# EAGLE design microBusPirate-v3 (EAGLE 5.11)

## Sheet 1 of 2
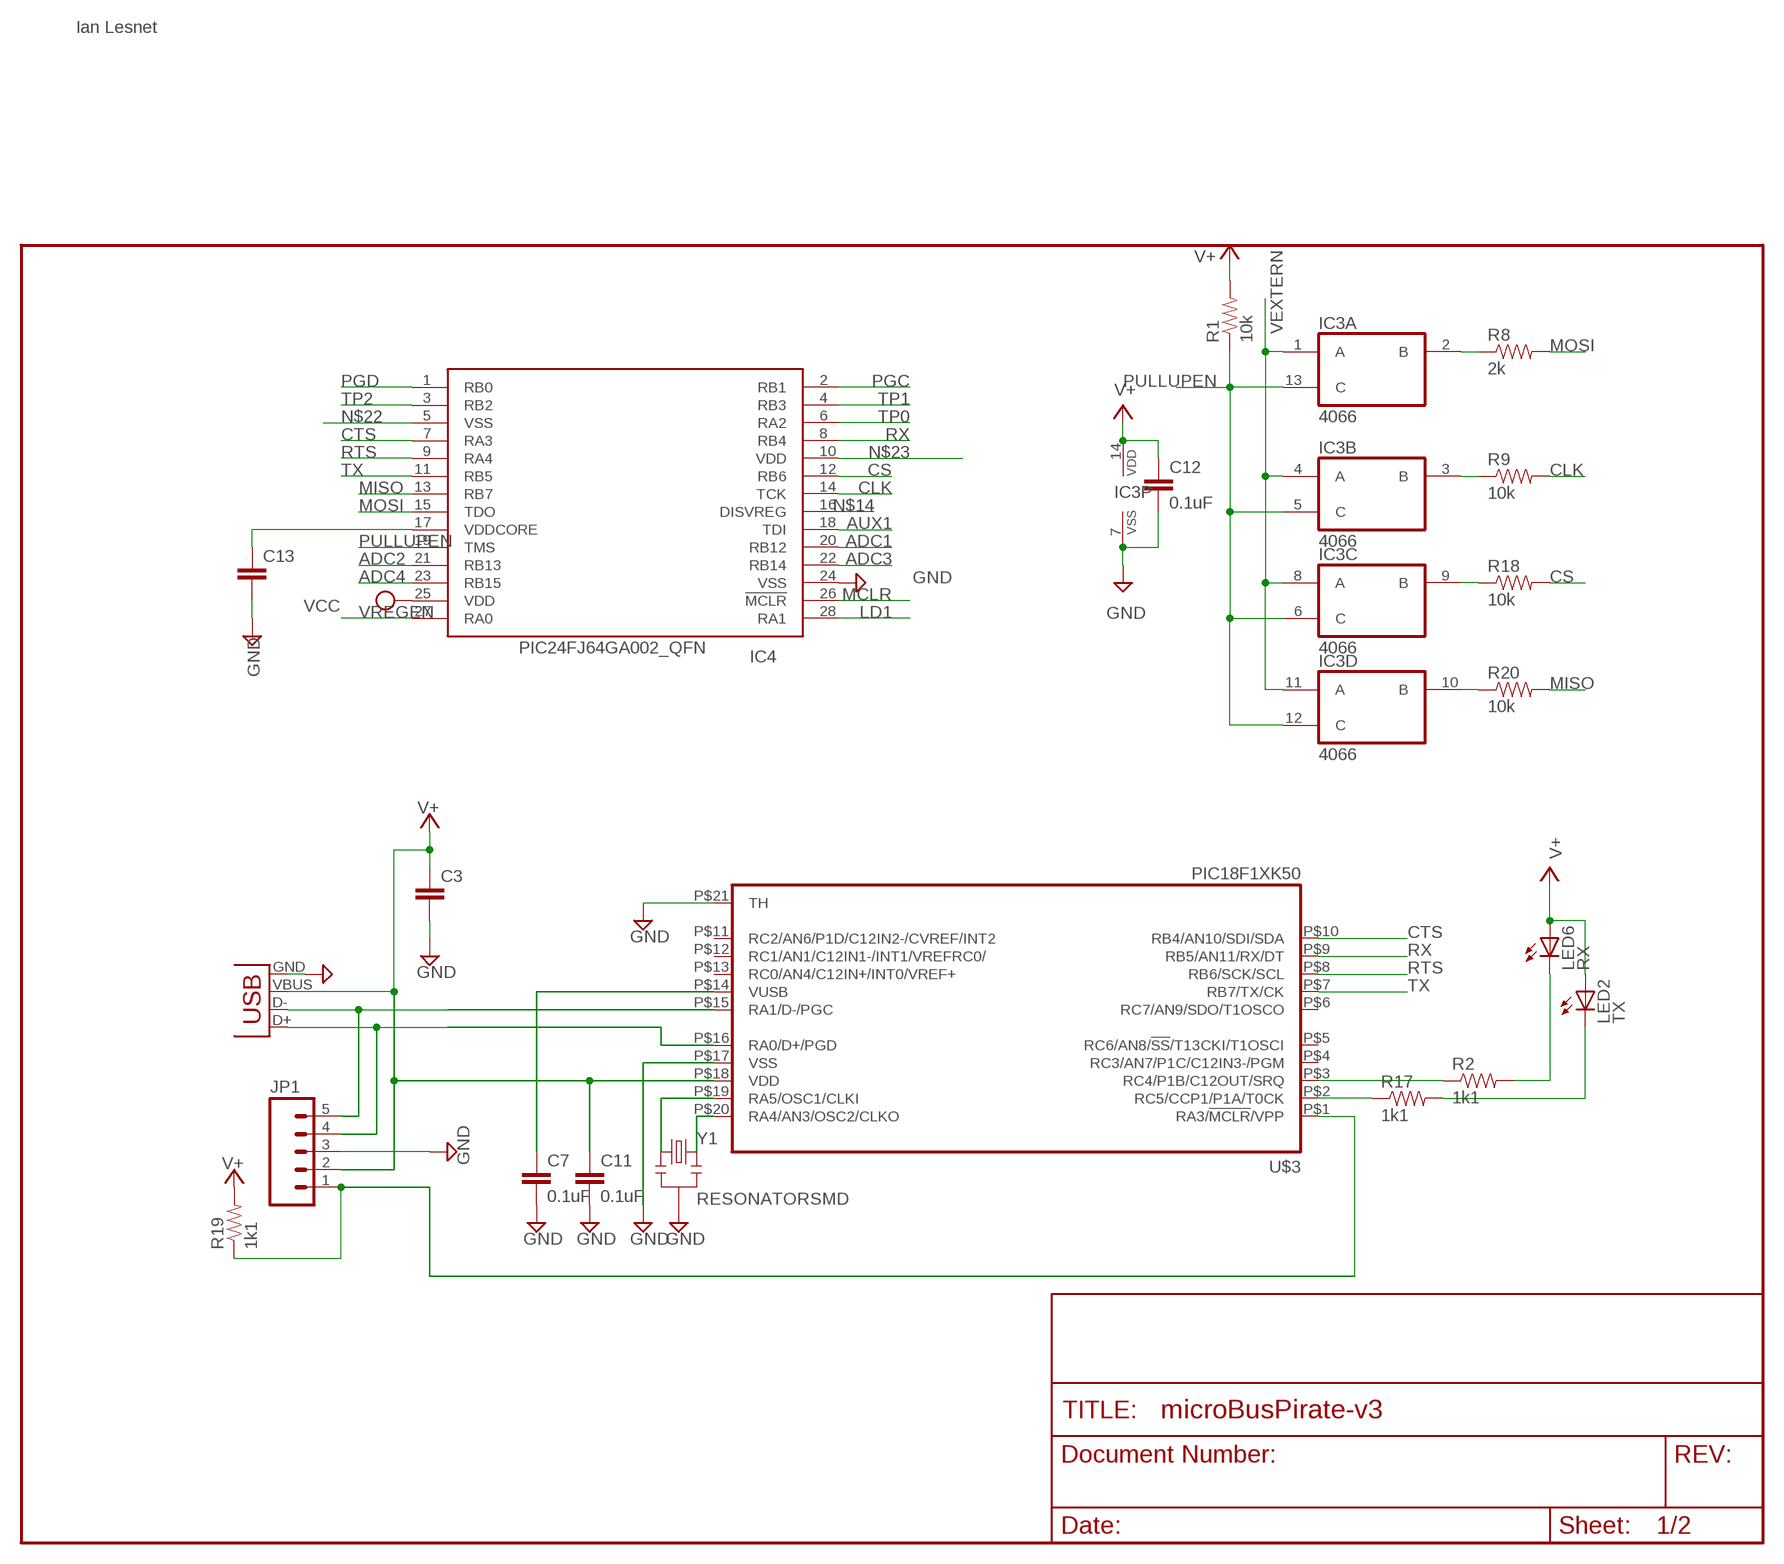
[diagram p0: schematic, sheet 1]

### Parts
C3  CAP0805  [0805]
C7  0.1uF  CAP  [0402-RES]
C11  0.1uF  CAP  [0402-RES]
C12  0.1uF  CAP  [0402-RES]
C13  CAP0805  [0805]
IC3  4066  [TSSOP14]
IC4  PIC24FJ64GA002_QFN  [QFN28-ML_6X6MM]
JP1  M051.27MM  [1X05-1.27MM]
LED2  TX  LED0603  [LED-0603]
LED6  RX  LED0603  [LED-0603]
R1  10k  RESISTOR0402-RES  [0402-RES]
R2  1k1  RESISTOR0402-RES  [0402-RES]
R8  2k  RESISTOR0402-RES  [0402-RES]
R9  10k  RESISTOR0402-RES  [0402-RES]
R17  1k1  RESISTOR0402-RES  [0402-RES]
R18  10k  RESISTOR0402-RES  [0402-RES]
R19  1k1  RESISTOR0402-RES  [0402-RES]
R20  10k  RESISTOR0402-RES  [0402-RES]
U$3  PIC18F1XK50  [QFN20]
X2  USBSMD  [USB-MINIB]
Y1  RESONATORSMD  [RESONATOR-SMD]

### Nets
ADC1: IC4.20(RB12) ; also sheet 2
ADC2: IC4.21(RB13) ; also sheet 2
ADC3: IC4.22(RB14) ; also sheet 2
ADC4: IC4.23(RB15) ; also sheet 2
AUX1: IC4.18(TDI) ; also sheet 2
CLK: IC4.14(TCK) R9.2 ; also sheet 2
CS: IC4.12(RB6) R18.2 ; also sheet 2
CTS: IC4.7(RA3) U$3.P$10(RB4/AN10/SDI/SDA)
D+: JP1.4 U$3.P$16(RA0/D+/PGD) X2.D+
D-: JP1.5 U$3.P$15(RA1/D-/PGC) X2.D-
GND: C3.2 C7.2 C11.2 C12.2 C13.2 IC3.7(P:VSS) IC4.24(VSS) JP1.3 U$3.P$17(VSS) U$3.P$21(TH) X2.GND Y1.2 ; also sheet 2
LD1: IC4.28(RA1) ; also sheet 2
MCLR: IC4.26(!MCLR) ; also sheet 2
MISO: IC4.13(RB7) R20.2 ; also sheet 2
MOSI: IC4.15(TDO) R8.2 ; also sheet 2
N$1: IC3.2(A:B) R8.1
N$2: IC3.3(B:B) R9.1
N$3: C13.1 IC4.17(VDDCORE)
N$4: IC3.10(D:B) R20.1
N$5: IC3.9(C:B) R18.1
N$8: C7.1 U$3.P$14(VUSB)
N$9: R17.1 U$3.P$2(RC5/CCP1/P1A/T0CK)
N$10: LED2.C R17.2
N$11: U$3.P$19(RA5/OSC1/CLKI) Y1.1
N$12: U$3.P$20(RA4/AN3/OSC2/CLKO) Y1.3
N$13: LED6.C R2.2
N$14: IC4.16(DISVREG)
N$19: R2.1 U$3.P$3(RC4/P1B/C12OUT/SRQ)
N$22: IC4.5(VSS)
N$23: IC4.10(VDD)
PGC: IC4.2(RB1) ; also sheet 2
PGD: IC4.1(RB0) ; also sheet 2
PULLUPEN: IC3.5(B:C) IC3.6(C:C) IC3.12(D:C) IC3.13(A:C) IC4.19(TMS) R1.1
RST: JP1.1 R19.1 U$3.P$1(RA3/!MCLR!/VPP)
RTS: IC4.9(RA4) U$3.P$8(RB6/SCK/SCL)
RX: IC4.8(RB4) U$3.P$9(RB5/AN11/RX/DT)
TP0: IC4.6(RA2)
TP1: IC4.4(RB3)
TP2: IC4.3(RB2)
TX: IC4.11(RB5) U$3.P$7(RB7/TX/CK)
V+: C3.1 C11.1 C12.1 IC3.14(P:VDD) JP1.2 LED2.A LED6.A R1.2 R19.2 U$3.P$18(VDD) X2.VBUS ; also sheet 2
VCC: IC4.25(VDD) ; also sheet 2
VEXTERN: IC3.1(A:A) IC3.4(B:A) IC3.8(C:A) IC3.11(D:A) ; also sheet 2
VREGEN: IC4.27(RA0) ; also sheet 2
Unconnected: U$3.P$4(RC3/AN7/P1C/C12IN3-/PGM) U$3.P$5(RC6/AN8/!SS!/T13CKI/T1OSCI) U$3.P$6(RC7/AN9/SDO/T1OSCO) U$3.P$11(RC2/AN6/P1D/C12IN2-/CVREF/INT2) U$3.P$12(RC1/AN1/C12IN1-/INT1/VREFRC0/) U$3.P$13(RC0/AN4/C12IN+/INT0/VREF+)

### Notes on the sheet
- Ian Lesnet

## Sheet 2 of 2
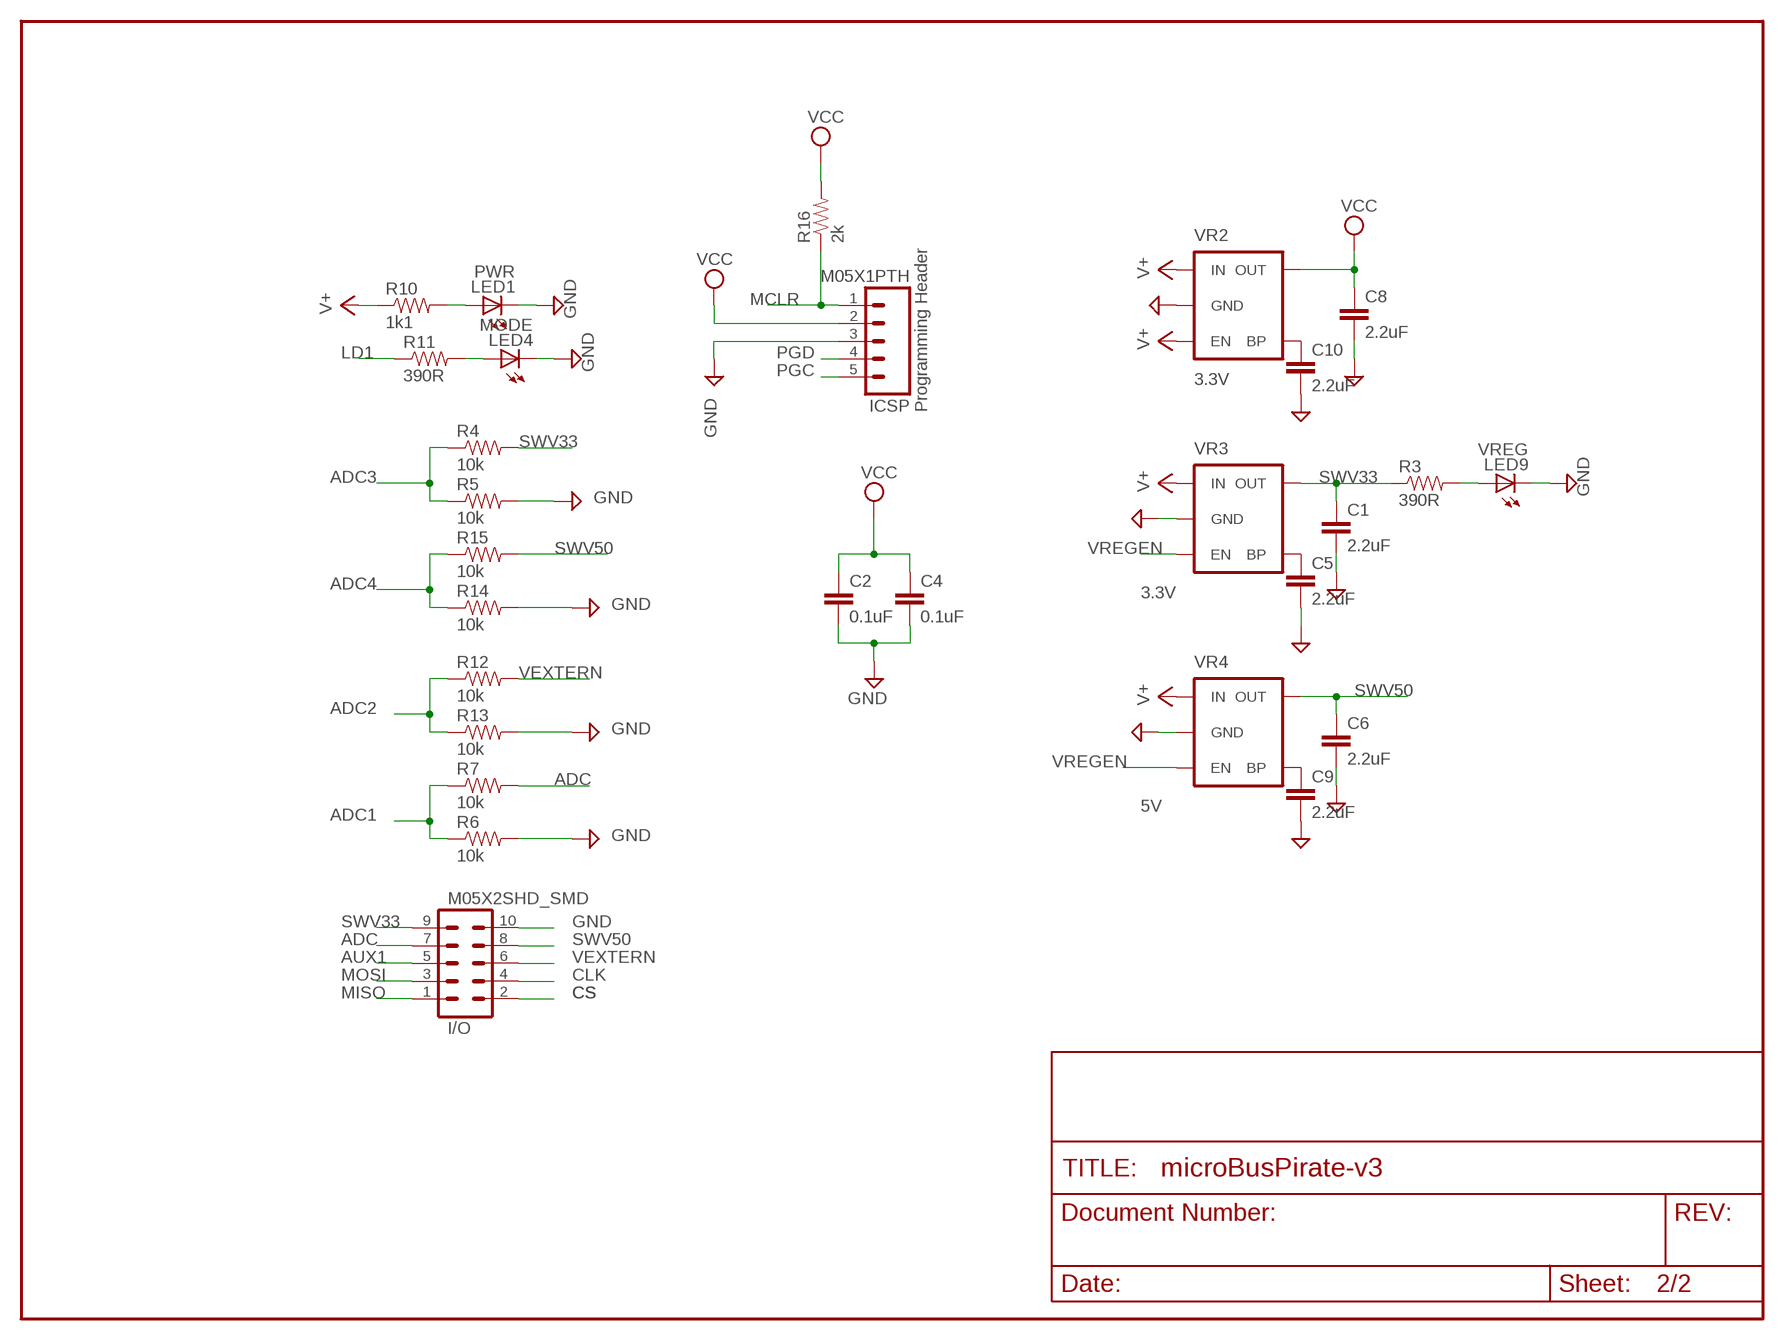
[diagram p1: schematic, sheet 2]

### Parts
C1  2.2uF  CAP  [0402-RES]
C2  0.1uF  CAP  [0402-RES]
C4  0.1uF  CAP  [0402-RES]
C5  2.2uF  CAP  [0402-RES]
C6  2.2uF  CAP  [0402-RES]
C8  2.2uF  CAP  [0402-RES]
C9  2.2uF  CAP  [0402-RES]
C10  2.2uF  CAP  [0402-RES]
I/O  M05X2SHD_SMD  [2X5-SHROUDED_SMD]
ICSP  M05X1PTH  M051.27MM  [1X05-1.27MM]
LED1  PWR  LED0603  [LED-0603]
LED4  MODE  LED0603  [LED-0603]
LED9  VREG  LED0603  [LED-0603]
R3  390R  RESISTOR0402-RES  [0402-RES]
R4  10k  RESISTOR0402-RES  [0402-RES]
R5  10k  RESISTOR0402-RES  [0402-RES]
R6  10k  RESISTOR0402-RES  [0402-RES]
R7  10k  RESISTOR0402-RES  [0402-RES]
R10  1k1  RESISTOR0402-RES  [0402-RES]
R11  390R  RESISTOR0402-RES  [0402-RES]
R12  10k  RESISTOR0402-RES  [0402-RES]
R13  10k  RESISTOR0402-RES  [0402-RES]
R14  10k  RESISTOR0402-RES  [0402-RES]
R15  10k  RESISTOR0402-RES  [0402-RES]
R16  2k  RESISTOR0402-RES  [0402-RES]
VR2  3.3V  V_REG_LDOSMD  [SOT23-5]
VR3  3.3V  V_REG_LDOSMD  [SOT23-5]
VR4  5V  V_REG_LDOSMD  [SOT23-5]

### Nets
ADC: I/O.7 R7.2
ADC1: R6.1 R7.1 ; also sheet 1
ADC2: R12.1 R13.1 ; also sheet 1
ADC3: R4.1 R5.1 ; also sheet 1
ADC4: R14.1 R15.1 ; also sheet 1
AUX1: I/O.5 ; also sheet 1
CLK: I/O.4 ; also sheet 1
CS: I/O.2 ; also sheet 1
GND: C1.2 C2.2 C4.2 C5.2 C6.2 C8.2 C9.2 C10.2 I/O.10 ICSP.3 LED1.C LED4.C LED9.C R5.2 R6.2 R13.2 R14.2 VR2.2(GND) VR3.2(GND) VR4.2(GND) ; also sheet 1
LD1: R11.1 ; also sheet 1
MCLR: ICSP.1 R16.1 ; also sheet 1
MISO: I/O.1 ; also sheet 1
MOSI: I/O.3 ; also sheet 1
N$6: LED4.A R11.2
N$7: LED1.A R10.2
N$15: C9.1 VR4.4(BP)
N$16: C5.1 VR3.4(BP)
N$17: C10.1 VR2.4(BP)
N$18: LED9.A R3.2
PGC: ICSP.5 ; also sheet 1
PGD: ICSP.4 ; also sheet 1
SWV33: C1.1 I/O.9 R3.1 R4.2 VR3.5(OUT)
SWV50: C6.1 I/O.8 R15.2 VR4.5(OUT)
V+: R10.1 VR2.1(IN) VR2.3(EN) VR3.1(IN) VR4.1(IN) ; also sheet 1
VCC: C2.1 C4.1 C8.1 ICSP.2 R16.2 VR2.5(OUT) ; also sheet 1
VEXTERN: I/O.6 R12.2 ; also sheet 1
VREGEN: VR3.3(EN) VR4.3(EN) ; also sheet 1

### Notes on the sheet
- Programming Header

## Library data of the parts
C1 C2 C4-C12 = Gregs:CAP: Capacitor Standard 0603 ceramic capacitor, and 0.1" leaded capacitor.
C3 C13 = SparkFun:CAP: Capacitor Standard 0603 ceramic capacitor, and 0.1" leaded capacitor.
I/O = SparkFun:M05X2: Header 5x2 Standard 10-pin dual row 0.1" header. Commonly used with AVR-ISP. Use with Spark Fun Electronics SKU: PRT-00778
IC3 = Gregs:4066: Quad bilateral ANALOG SWITCH
IC4 = microchip:PIC24FJ64GA002_QFN: PIC24FJ64GA002_QFN edit this description Auto generated by make-symbol-device-package-bsdl.ulp Rev. 25 Source: PIC24FJ64GA002_QFN.bsd
ICSP JP1 = SparkFun:M05: Header 5 Standard 5-pin 0.1" header. Use with straight break away headers (SKU : PRT-00116), right angle break away headers (PRT-00553), swiss pins (PRT-00743), machine pins (PRT-00117), and female headers (PRT-00115). Molex polarized connector foot print use with SKU : PRT-08230 with associated crimp pins and housings.
LED1 LED2 LED4 LED6 LED9 = SparkFun:LED: LEDs Standard schematic elements and footprints for 5mm, 3mm, 1206, and 0603 sized LEDs. 5mm - Spark Fun Electronics SKU : COM-00529 (and others)
R1-R20 = Gregs:RESISTOR: Resistor Basic schematic elements and footprints for 0603, 1206, and PTH 1/10th watt (small) resistors.
U$3 = Gregs:PIC18F1XK50
VR2-VR4 = SparkFun:V_REG_LDO: Voltage Regulator LDO Standard 150mA LDO voltage regulator in SOT-23 layout. Micrel part MIC5205. BP (by-pass) pin is used to lower output noise with 470pF cap.
X2 = SparkFun:USB: USB Connectors USB-B-PTH is fully proven SKU : PRT-00139 USB-miniB is fully proven SKU : PRT-00587 USB-A-PCB is untested. USB-A-H is throughly reviewed, but untested. Spark Fun Electronics SKU : PRT-00437 USB-B-SMT is throughly reviewed, but untested. Needs silkscreen touching up. USB-A-S has not been used/tested USB-MB-H has not been used/tested
Y1 = SparkFun:RESONATOR: Resonator Small SMD resonator. This is the itty bitty 10/20MHz resonators with built in caps. CSTCE10M0G55 and CSTCE20M0V53. Footprint has been reviewed closely but hasn't been tested yet.

## Board
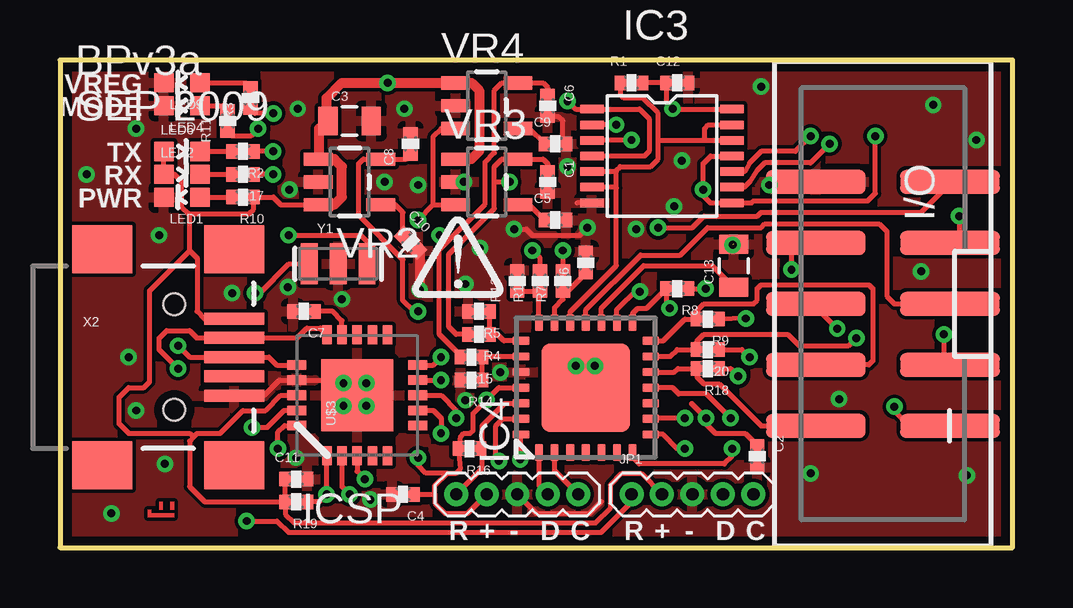
[diagram p2: board, top side]
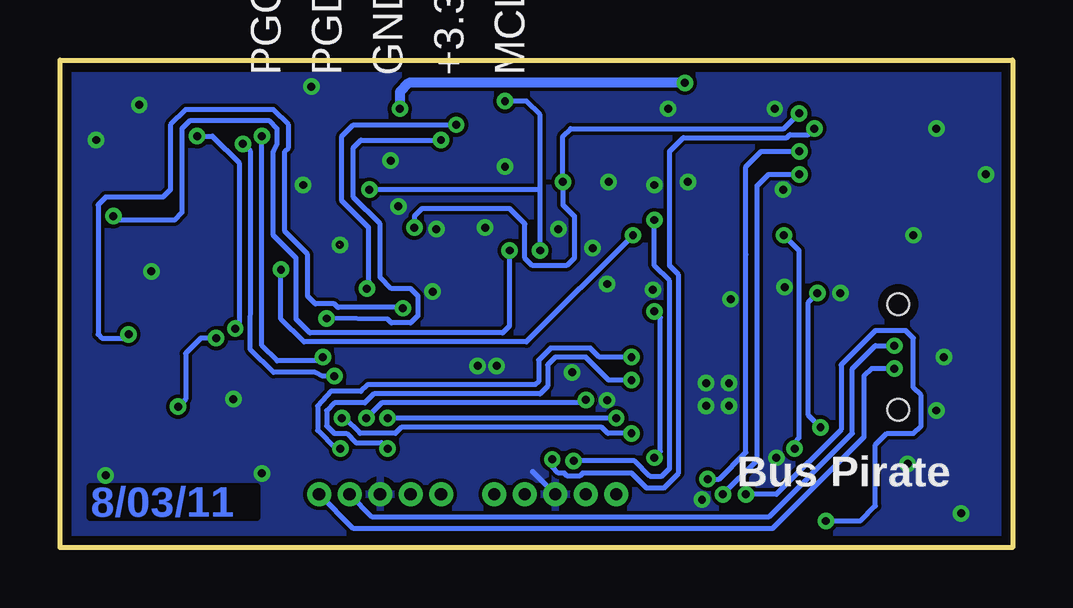
[diagram p3: board, bottom side, seen from below]

Size 39.69 x 20.32 mm. Coordinates in mm from the lower left corner, seen from the top.
Outline: 39.69,0 39.69,20.32 0,20.32 0,0 39.69,0
Copper layers (1*16): Top 0.0356mm / dielectric 1.5011mm / Bottom 0.0356mm
Design rules "LaenPCBOrder": minimum track width 6mil, minimum drill 13mil, track to track 6mil, track to pad 6mil, pad to pad 6mil, via to via 6mil, smd to smd 6mil, copper to edge 15mil, drill to drill 6mil, minimum pad ring 7mil, minimum via ring 7mil, stop-mask expansion 4mil, vias tented up to drill 20mil, thermal gap 10mil

### Footprints (pad centres in the part's own frame; a part is rotated, then mirrored left to right if it is on the bottom)
0402-RES = smd 0.5 x 0.6: 1 -0.45,0; 2 0.45,0
0805 = smd 0.8 x 1.2: 1 -0.9,0; 2 0.9,0
2X5-SHROUDED_SMD = smd 4.15 x 1: 1 -2.794,5.08; 2 2.794,5.08; 3 -2.794,2.54; 4 2.794,2.54; 5 -2.794,0; 6 2.794,0; 7 -2.794,-2.54; 8 2.794,-2.54; 9 -2.794,-5.08; 10 2.794,-5.08
TSSOP14 = smd 0.356 x 0.991: 1 -1.95,-2.918; 2 -1.3,-2.918; 3 -0.65,-2.918; 4 0,-2.918; 5 0.65,-2.918; 6 1.3,-2.918; 7 1.95,-2.918; 8 1.95,2.918; 9 1.3,2.918; 10 0.65,2.918; 11 0,2.918; 12 -0.65,2.918; 13 -1.3,2.918; 14 -1.95,2.918
QFN28-ML_6X6MM = smd 0.7 x 0.35: 1 -2.7,1.95; 2 -2.7,1.3; 3 -2.7,0.65; 4 -2.7,0; 5 -2.7,-0.65; 6 -2.7,-1.3; 7 -2.7,-1.95; 15 2.7,-1.95; 16 2.7,-1.3; 17 2.7,-0.65; 18 2.7,0; 19 2.7,0.65; 20 2.7,1.3; 21 2.7,1.95 | smd 0.35 x 0.7: 8 -1.95,-2.7; 9 -1.3,-2.7; 10 -0.65,-2.7; 11 0,-2.7; 12 0.65,-2.7; 13 1.3,-2.7; 14 1.95,-2.7; 22 1.95,2.7; 23 1.3,2.7; 24 0.65,2.7; 25 0,2.7; 26 -0.65,2.7; 27 -1.3,2.7; 28 -1.95,2.7 | smd 3.7 x 3.7: EXP 0,0
1X05-1.27MM = drill 0.508 pad 1 round: 1 0,0; 2 1.27,0; 3 2.54,0; 4 3.81,0; 5 5.08,0
LED-0603 = smd 0.8 x 0.8: A 0,-0.75; C 0,0.75
QFN20 = smd 0.8 x 0.4: P$1 -2.52,1.26; P$2 -2.52,0.63; P$3 -2.52,0; P$4 -2.52,-0.63; P$5 -2.52,-1.26; P$11 2.52,-1.26; P$12 2.52,-0.63; P$13 2.52,0; P$14 2.52,0.63; P$15 2.52,1.26 | smd 0.4 x 0.8: P$6 -1.26,-2.52; P$7 -0.63,-2.52; P$8 0,-2.52; P$9 0.63,-2.52; P$10 1.26,-2.52; P$16 1.26,2.52; P$17 0.63,2.52; P$18 0,2.52; P$19 -0.63,2.52; P$20 -1.26,2.52 | smd 3 x 3: P$21 0,0
SOT23-5 = smd 0.55 x 1.2: 1 -0.95,-1.3; 2 0,-1.3; 3 0.95,-1.3; 4 0.95,1.3; 5 -0.95,1.3
USB-MINIB = smd 2.5 x 0.5: D+ 2.5,0; D- 2.5,0.8; GND 2.5,-1.6; ID 2.5,-0.8; VBUS 2.5,1.6 | smd 2.5 x 2: GND@1 -3,-4.5; GND@2 -3,4.5; GND@3 2.5,4.5; GND@4 2.5,-4.5 | hole 0.9: 0,2.2; 0,-2.2
RESONATOR-SMD = smd 0.7 x 1.7: 1 -1.2,0; 2 0,0; 3 1.2,0

### Placement (x,y rotation side)
C1  20.32,15.24 270 top
C2  29.05,3.81 270 top
C3  12.06,17.78 0 top
C4  14.29,2.22 180 top
C5  20.64,13.65 0 top
C6  20.32,18.41 270 top
C7  10.16,9.84 180 top
C8  14.61,16.83 90 top
C9  20.64,16.83 0 top
C10  14.61,12.7 315 top
C11  9.84,2.86 0 top
C12  25.72,19.37 0 top
C13  28.07,11.75 90 top
I/O  34.29,10.16 180 top
IC3  25.08,16.32 270 top
IC4  21.91,6.67 90 top
ICSP  16.51,2.22 0 top
JP1  23.81,2.22 0 top
LED1  5.08,14.61 90 top
LED2  5.08,15.56 270 top
LED4  5.08,18.41 90 top
LED6  5.08,16.51 270 top
LED9  5.08,19.37 90 top
R1  23.81,19.37 0 top
R2  7.62,16.51 180 top
R3  7.94,18.73 90 top
R4  17.46,8.89 180 top
R5  17.46,9.84 180 top
R6  21.91,11.87 90 top
R7  20.95,11.11 90 top
R8  25.72,10.79 180 top
R9  26.99,9.53 180 top
R10  7.62,14.61 180 top
R11  6.99,17.78 90 top
R12  20,11.11 90 top
R13  19.05,11.11 90 top
R14  17.14,6.99 180 top
R15  17.14,7.94 180 top
R16  17.07,4.13 180 top
R17  7.62,15.56 180 top
R18  26.99,7.46 180 top
R19  9.84,1.91 180 top
R20  26.99,8.26 180 top
U$1  [DP-LOGO]  14.67,10.41 0 top
U$3  12.38,6.35 90 top
VR2  12.06,15.24 270 top
VR3  17.78,15.24 270 top
VR4  17.78,18.41 270 top
X2  4.76,7.94 0 top
Y1  11.59,11.83 0 top

### Tracks (layer width: path | path; a pad name or v marks a point on that pad's centre or on a via)
ADC  (via drill 0.33)
  Top 0.203: v20.95,12.38 R7.2 | I/O.7 37.47,12.7 v37.47,13.81
  Bottom 0.203: v20.95,12.38 20.95,9.24 21.24,8.95 29.27,8.95 29.84,9.53 29.84,12.06 30.8,13.02 30.8,16.51 30.64,16.83 30.64,17.46 30.96,17.78 34.29,17.78 34.61,17.46 34.61,13.97 34.92,13.65 37.31,13.65 v37.47,13.81
ADC1
  Top 0.203: IC4.20 20.61,10 20.95,10.35 R7.1 21.14,10.66 R6.1
ADC2
  Top 0.203: IC4.21 19.96,10.62 R12.1 R13.1
ADC3
  Top 0.203: IC4.22 18.5,8.62 18.22,8.89 R4.1 R5.1
ADC4
  Top 0.203: IC4.23 17.62,7.97 R15.1 R14.1
AUX1
  Top 0.203: IC4.18 21.91,9.91 24.19,12.19 25.84,12.19 26.99,13.34 29.21,13.34 29.37,13.49 29.53,13.49 34.13,13.49 34.45,13.18 34.45,10.48 34.77,10.16 I/O.5
CLK
  Top 0.203: IC4.14 25.13,8.62 26.04,9.53 R9.2 26.54,9.87 26.83,10.16 28.89,10.16 29.05,10.32 29.05,10.79 29.21,10.95 33.71,10.95 33.87,10.79 33.87,7.78 33.71,7.62 I/O.4
CS
  Top 0.203: IC4.12 25.58,7.32 25.75,7.46 R18.2 26.54,7.12 26.83,6.83 27.46,6.83 29.21,5.08 I/O.2 32.38,5.08
CTS  (via drill 0.33)
  Top 0.203: U$3.P$10 15.55,7.61 v15.88,7.94 | IC4.7 23.86,3.77 24.13,3.49 27.69,3.49 28,3.81 v28,4.13
  Bottom 0.203: v28,4.13 28.19,4.13 28.96,4.89 28.96,5.91 28.42,6.51 27.15,6.51 26.86,6.79 19.88,6.79 19.75,6.92 19.75,7.81 19.24,8.32 17.59,8.32 17.21,7.94 v15.88,7.94
D+  (via drill 0.33)
  Top 0.203: U$3.P$16 9.03,7.61 8.7,7.94 X2.D+ 5.4,7.94 v4.92,8.41
  Bottom 0.203: JP1.4 26.67,1.27 10.16,1.27 6.67,4.76 6.67,7.46 5.71,8.41 v4.92,8.41
D-  (via drill 0.33)
  Top 0.203: U$3.P$15 10.85,9.14 10.29,9.14 9.88,8.74 X2.D- 5.72,8.74 5.71,8.73 5.4,9.05 4.45,9.05 4.13,8.73 4.13,8.26 v4.92,7.46
  Bottom 0.203: JP1.5 27.46,0.79 10,0.79 6.19,4.6 6.19,7.14 5.87,7.46 v4.92,7.46
GND  (via drill 0.33)  (1 unrouted)
  Top 0.203: IC3.7 21.55,14.37 | R6.2 21.91,12.51 | v11.81,6.86 11.69,6.98 U$3.P$17 9.14,6.98 8.5,6.34 X2.GND | C6.2 20.77,17.96 20.95,17.78 20.95,16.96 C9.2 | v18.92,13.27 19.43,13.27 19.68,13.02 21.65,13.02 v21.97,13.34 | v29.56,15.11 31.37,15.11 I/O.10 | 22.56,1.92 22.07,1.43 19.84,1.43 ICSP.3
  Top 0.406: v14.99,10.75 14.99,12.32 C10.2
  Bottom 0.203: ICSP.3 20,3.17
  other vias: 4.13,13.02 16.89,6.14 18.35,7.3 24.16,10.67 16.83,15.24 16.89,10.99 11.81,5.91 12.76,6.86 12.76,5.91 14.35,18.29 9.91,18.29 9.84,3.75 9.49,10.86 11.75,10.35 13.53,15.24 7.18,10.6 2.86,7.94 21.15,15.88 36.39,18.45 28.03,12.62 17.49,12.48 12.94,2 14.92,15.11 3.17,5.71 21.49,7.57 22.29,7.57 9.55,14.92 1.11,15.56 3.17,17.46 29.21,19.21 4.37,3.49 2.14,1.43 31.27,3.1 37.78,3.02 32.46,6.19 38.18,16.99 35.88,11.51 25.91,16.13 24,13.27 25.59,14.22
  pour Top (isolate 0.152): 0,20.32 39.69,20.32 39.69,0 0,0
  pour Bottom: 0,20.32 39.69,20.32 39.69,0 0,0
LD1  (via drill 0.33)
  Top 0.203: IC4.28 19.21,3.71 v19.18,3.68 | v8.26,17.46 7.94,17.14 7.17,17.14 R11.1
  Bottom 0.203: v19.18,3.68 19.18,3.37 18.92,3.11 18.67,3.11 18.54,2.98 18.03,2.98 17.91,3.11 15.88,3.11 15.24,2.48 14.54,2.48 13.91,3.11 13.91,11.37 14.29,11.75 14.29,16.51 13.72,17.08 9.4,17.08 9.27,17.21 8.51,17.21 v8.26,17.46
MCLR
  Top 0.203: IC4.26 18.53,6.02 17.59,5.08 17.59,4.13 | 17.59,4.13 R16.1 | 17.59,4.13 17.59,3.3 ICSP.1
MISO  (via drill 0.33)
  Top 0.203: IC4.13 25.43,7.97 25.72,8.26 R20.2 26.54,8.6 26.83,8.89 30.32,8.89 30.8,8.41 32.86,8.41 v33.18,8.73 | v34.77,5.87 34.77,5.71 35.4,5.08 I/O.1
  Bottom 0.203: v33.18,8.73 33.81,8.73 34.45,8.1 34.45,6.19 v34.77,5.87
MOSI  (via drill 0.33)
  Top 0.203: IC4.15 23.86,9.76 24.07,9.97 24.44,9.97 R8.2 25.27,10.13 v25.4,9.98 | v36.83,8.89 36.83,7.87 I/O.3
  Bottom 0.203: v25.4,9.98 25.5,9.98 25.53,10.01 28.09,10.01 28.1,10 28.26,10.16 29.05,10.16 29.37,10.48 29.37,12.22 30.32,13.18 30.32,16.51 30.16,16.67 30.16,17.62 30.8,18.26 34.45,18.26 35.08,17.62 35.08,14.92 35.4,14.61 37.78,14.61 38.1,14.29 38.1,8.89 37.94,8.73 36.99,8.73 v36.83,8.89
N$1  (via drill 0.33)
  Top 0.203: R8.1 v26.91,10.79 | IC3.2 v23.18,17.62
  Bottom 0.203: v26.91,10.79 26.91,11.02 26.82,11.1 26.83,13.34 27.94,14.45 27.94,17.14 27.46,17.62 v23.18,17.62
N$2  (via drill 0.33)
  Top 0.203: v28.57,9.55 R9.1 | IC3.3 23.8,16.97 v23.81,16.99
  Bottom 0.203: v28.57,9.55 26.04,9.53 25.88,9.37 25.08,9.37 24.77,9.68 24.77,10.48 25.08,10.79 25.88,10.79 26.35,11.27 26.35,13.49 27.46,14.61 27.46,16.67 27.15,16.99 v23.81,16.99
N$3
  Top 0.203: IC4.17 22.56,9.98 24.32,11.75 27.18,11.75 27.76,11.16 C13.1
N$4  (via drill 0.33)
  Top 0.203: R20.1 28.42,8.26 v28.73,7.94 | v31.27,17.14 30.64,16.51 29.21,16.51 28.73,16.03 28.53,15.67 IC3.10
  Bottom 0.203: v28.73,7.94 28.89,7.78 30.64,7.78 31.27,8.41 v31.27,17.14
N$5  (via drill 0.33)
  Top 0.203: R18.1 27.94,7.46 v28.26,7.14 | IC3.9 28.51,15.02 28.73,15.24 29.05,15.72 29.37,16.03 31.27,16.03 v32.07,16.83
  Bottom 0.203: v28.26,7.14 28.73,7.14 29.05,7.3 30.8,7.3 31.75,8.26 31.75,11.11 31.75,16.51 v32.07,16.83
N$6
  Top 0.203: LED4.A 6.8,18.41 R11.2
N$7
  Top 0.203: LED1.A R10.2
N$8
  Top 0.203: C7.1 11.37,9.84 11.75,9.46 U$3.P$14
N$9  (via drill 0.33)
  Top 0.203: U$3.P$2 11.75,2.54 v12.06,2.22 | v8.88,15.56 R17.1
  Bottom 0.203: v12.06,2.22 10.64,3.65 10.64,15.08 10.16,15.56 v8.88,15.56
N$10
  Top 0.203: LED2.C R17.2
N$11  (via drill 0.33)
  Top 0.203: U$3.P$19 9.34,5.72 8.64,5.02 v8,5.02 | v8.13,10.6 8.32,10.6 9.54,11.83 Y1.1
  Bottom 0.203: v8,5.02 8.51,5.52 8.51,10.22 v8.13,10.6
N$12  (via drill 0.33)
  Top 0.203: U$3.P$20 9.35,5.09 9.08,4.83 v9.08,4.13 | Y1.3 12.79,12.77 12.54,13.02 v9.53,13.02
  Bottom 0.203: v9.53,13.02 8.89,12.38 8.89,4.57 9.08,4.38 v9.08,4.13
N$13
  Top 0.203: LED6.C R2.2
N$14
  Top 0.203: IC4.16 23.21,9.94 24.07,10.79
N$15
  Top 0.203: VR4.4 19.55,17.46 C9.1
N$16
  Top 0.203: VR3.4 19.55,14.29 C5.1
N$17
  Top 0.203: VR2.4 13.97,14.29 14.29,13.97 C10.1
N$18
  Top 0.203: LED9.A 7.75,19.37 R3.2
N$19  (via drill 0.33)
  Top 0.203: U$3.P$3 12.38,3.17 v12.7,2.86 | v8.88,16.51 R2.1
  Bottom 0.203: v12.7,2.86 12.22,2.86 11.11,3.97 11.11,12.22 | 11.11,12.22 | 11.11,12.22 11.11,15.88 10.48,16.51 v8.88,16.51
PGC
  Top 0.203: IC4.2 20.61,3.21 ICSP.5
PGD
  Top 0.203: IC4.1 19.96,2.58 ICSP.4
PULLUPEN
  Top 0.203: IC4.19 21.26,9.83 23.18,11.75 23.18,14.99 | 23.18,14.99 23.18,15.68 | 23.18,15.68 23.18,15.72 23.34,15.88 24.61,15.88 24.92,16.19 24.92,16.95 | 24.92,16.95 24.92,17.46 24.92,17.62 24.92,18.1 24.29,18.73 23.5,18.73 23.36,18.86 R1.1 | IC3.6 23.14,15.02 23.18,14.99 | IC3.5 23.16,15.67 23.18,15.68 | 26.86,16.97 24.94,16.97 24.92,16.95 | 26.86,16.97 IC3.12 | IC3.13 27.02,17.62 26.86,17.46 26.86,16.97
RST  (via drill 0.33)
  Top 0.203: U$3.P$1 11.12,2.23 v11.11,2.22 10.79,1.91 R19.1 | v7.78,1.11 9.05,1.11 9.53,0.64 22.54,0.64 23.81,1.91 JP1.1
  Bottom 0.203: v11.11,2.22 9.84,2.22 7.14,4.92 7.14,7.62 5.71,9.05 4.45,9.05 4.13,8.73 4.13,6.67 3.81,6.35 3.81,5.08 4.13,4.76 5.24,4.76 5.71,4.29 5.71,1.75 6.35,1.11 v7.78,1.11
RTS  (via drill 0.33)
  Top 0.203: U$3.P$8 15.88,6.35 16.51,5.71 v16.51,5.4 | v26.04,5.4 24.64,5.4 IC4.9
  Bottom 0.203: v16.51,5.4 v26.04,5.4
RX  (via drill 0.33)
  Top 0.203: U$3.P$9 v15.87,6.98 v15.88,6.99 | IC4.8 25.13,4.72 25.72,4.13 v26.04,4.13
  Bottom 0.203: v15.88,6.99 16.83,6.99 17.78,7.94 19.05,7.94 19.37,7.62 19.37,6.73 19.68,6.41 26.61,6.41 26.99,6.03 28.26,6.03 28.57,5.71 28.57,5.08 28.26,4.76 27.75,4.76 27.37,4.38 26.29,4.38 v26.04,4.13
SWV33  (via drill 0.33)
  Top 0.203: C1.1 20.32,16 20.13,16.19 VR3.5 18.41,16.19 18.1,15.88 18.1,15.24 | R4.2 16.51,8.89 16.19,9.21 16.19,12.22 18.1,14.13 18.1,15.24 | v8.89,18.1 8.12,18.1 R3.1 | 18.1,15.24 v18.73,15.24 | v24.92,13.34 26.35,13.34 26.83,13.81 29.05,13.81 29.21,13.97 35.88,13.97 37.15,15.24 | 37.15,15.24 I/O.9 37.24,15.4 37.62,15.4 37.47,15.24 37.15,15.24
  Bottom 0.203: v8.89,18.1 9.53,17.46 18.41,17.46 18.73,17.14 v18.73,15.24 18.73,14.29 18.26,13.81 18.26,12.06 18.57,11.75 20,11.75 20.32,12.06 20.32,13.49 20.95,14.13 24.61,14.13 24.92,13.81 v24.92,13.34
SWV50  (via drill 0.33)
  Top 0.203: C6.1 20.32,19.18 20.13,19.36 VR4.5 18.41,19.37 18.1,19.05 18.1,16.45 17.72,16.07 17.72,14.32 15.81,12.41 | R15.2 16.7,8.01 15.81,8.89 15.81,12.41 | 15.81,12.41 v15.81,13.02 | v30.48,11.59 30.48,12.7 I/O.8
  Bottom 0.203: v30.48,11.59 30.48,9.53 29.53,8.57 20.26,8.57 v15.81,13.02
TX  (via drill 0.33)
  Top 0.203: U$3.P$7 15.55,5.72 15.88,5.4 v15.88,4.76 | IC4.11 25.53,6.67 25.78,6.41 26.92,6.41 v27.94,5.4
  Bottom 0.203: v15.88,4.76 16.86,4.76 17.11,5.02 25.46,5.02 25.72,4.76 27.18,4.76 27.81,5.4 v27.94,5.4
V+  (via drill 0.33)
  Top 0.203: LED6.A LED2.A 4.76,15.56 5.08,15.24 5.08,14.16 5.33,13.91 5.4,13.91 | 5.4,13.91 7.87,13.91 8.07,14.1 R10.1 8.89,14.61 9.21,14.29 VR2.3 | R1.2 C12.1 25.27,18.54 25.4,18.41 | IC3.14 25.55,18.27 25.4,18.41 | C3.1 11.11,17.78 | 16.51,19.37 VR4.1 | v25.53,18.29 25.43,18.29 25.4,18.41 | U$3.P$18 9.21,6.35 8.57,5.71 7.62,5.71 6.67,4.76 5.71,4.76 5.56,4.6 | R19.2 6.03,1.91 5.4,2.54 5.4,4.45 5.56,4.6 | R19.2 C11.1 | 5.4,12.38 5.4,13.91 | 5.4,12.38 3.73,10.72 3.73,6.91 3.49,6.67 2.86,6.67 2.46,6.27 2.46,5.16 2.86,4.76 5.4,4.76 5.56,4.6 | JP1.2 24.21,3.1 23.42,3.1 22.94,2.62 22.94,1.67 22.3,1.03 9.76,1.03 9.39,1.4 R19.2 | X2.VBUS 6.02,9.54 5.71,9.84 5.71,12.06 5.4,12.38
  Top 0.406: C3.1 10.85,17.46 10.79,17.46 10.79,16.19 VR2.1 11.43,16.19 11.75,15.88 11.75,14.61 11.43,14.29 VR2.3 | VR3.1 17.14,16.19 17.46,16.51 17.46,19.05 17.15,19.36 VR4.1 | 16.51,19.37 v13.65,19.37 11.75,19.37 11.11,18.73 11.11,17.78
  Bottom 0.406: v13.65,19.37 25.15,19.37 25.53,18.99 v25.53,18.29
VCC  (via drill 0.33)
  Top 0.203: 16.13,3.11 16.51,3.11 16.7,3.3 R16.2 16.7,4.63 16.83,4.76 17.08,4.76 17.21,4.89 17.21,5.59 v17.78,6.16 18.29,6.67 IC4.25 | 16.13,3.11 15.62,2.6 15.62,2.22 | 26.3,6.02 v26.92,5.4 26.92,5.14 27.3,4.76 28.55,4.76 C2.1 | C8.1 14.42,16.19 VR2.5 12.64,16.19 12.45,16 12.45,13.84 14.29,12 14.29,10.29 14.73,9.84 v14.92,9.84 | v14.92,3.75 14.92,3.43 15.24,3.11 16.13,3.11 | 15.62,2.22 15.62,1.86 16.05,1.43 16.99,1.43 ICSP.2 | C4.1 15.62,2.22
  Bottom 0.203: v26.92,5.4 26.29,6.03 17.91,6.03 v17.78,6.16 | v14.92,3.75 14.67,4 14.67,9.59 v14.92,9.84
VEXTERN  (via drill 0.33)
  Top 0.203: R12.2 20,12.06 v19.68,12.38 | IC3.4 24.35,16.32 24.54,16.51 24.54,17.88 24.15,18.27 IC3.1 21.48,18.27 v21.14,18.61 | 33.02,10.48 32.77,10.22 I/O.6 31.5,10.02 v32.38,9.13 | IC3.11 27.11,16.32 26.8,16 v26.8,14.92 26.8,14.67 27.1,14.37 IC3.8 28.82,14.37 28.89,14.45 33.66,14.45 33.97,14.76 v33.97,17.14
  Bottom 0.203: v19.68,12.38 19.68,14.92 | 19.68,14.92 19.68,18.03 20.26,18.61 v21.14,18.61 | 19.68,14.92 v26.8,14.92 | v32.38,9.13 32.38,9.21 32.23,9.37 32.23,16.03 33.34,17.14 v33.97,17.14
VREGEN  (via drill 0.33)
  Top 0.203: IC4.27 18.45,5.37 18.16,5.08 18.16,3.75 v18.29,3.62 | VR4.3 15.88,17.46 15.56,17.14 15.56,14.29 | v14.92,13.65 15.56,14.29 | VR3.3 15.56,14.29
  Bottom 0.203: v14.92,13.65 14.92,11.75 14.29,11.11 14.29,3.3 14.61,2.98 15.11,2.98 15.75,3.62 v18.29,3.62
(copper drawn outside any net)
  shapes: Top area x13

### Text on the board
Bottom: 8/03/11
tPlace: VREG | MODE | TX | RX | PWR | R | + | - | D | C | R | + | - | D | C
bPlace: Bus Pirate
tNames: BPv3a | SEP 2009
bNames: MCLR | +3.3V | GND | PGD | PGC
Reference: MCLR | +3.3V | GND | DATA | CLOCK | Programming Header